# EAGLE schematic 909 Rim (EAGLE 9.0.0)
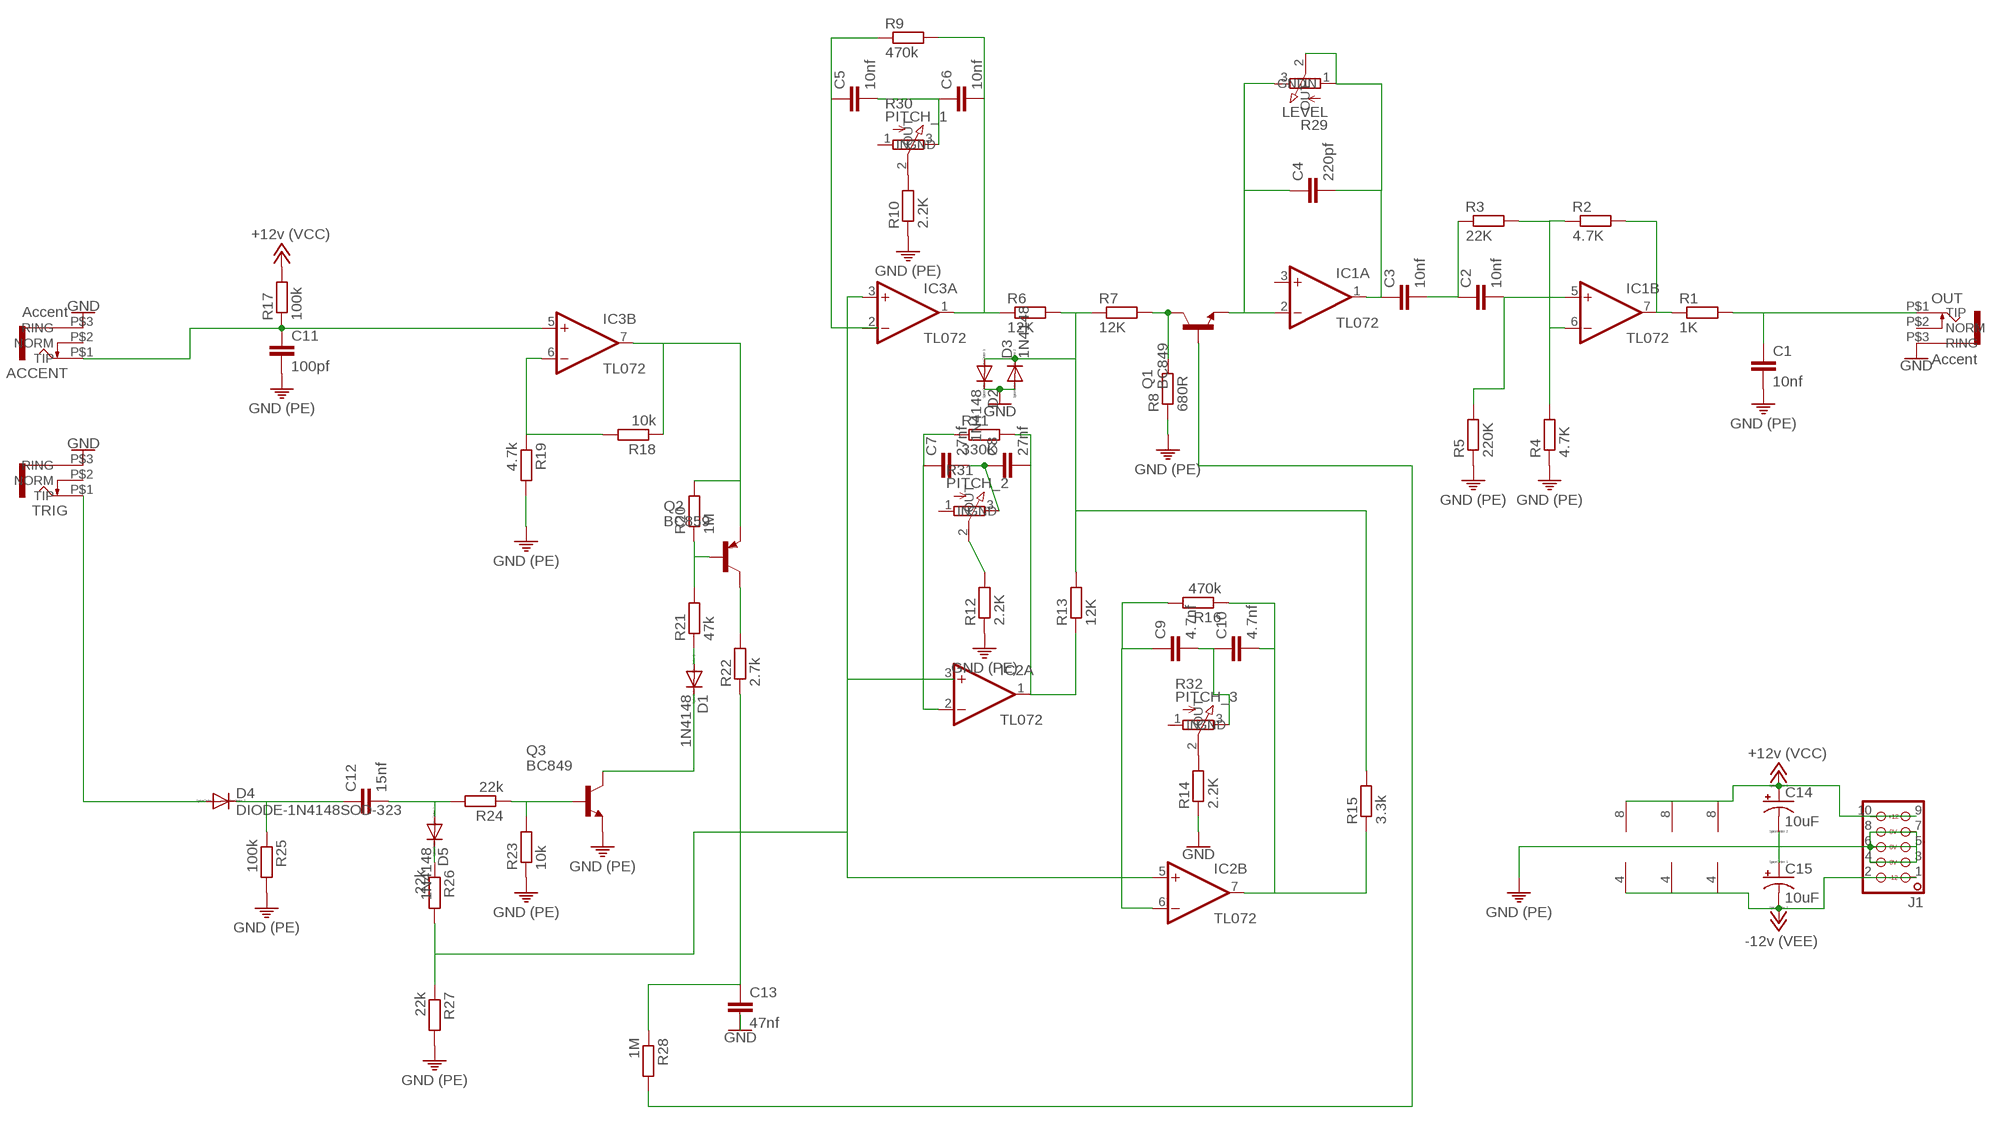
[diagram p0: schematic, sheet 1]

## Parts
ACCENT  Accent  JACK_KOBICONN_PJM301DM_V2  [KOBICONN_PJM301DM_JACK]
C1  10nf  CAPACITOR-EUC0603  [C0603]
C2  10nf  CAPACITOR-EUC0603  [C0603]
C3  10nf  CAPACITOR-EUC0603  [C0603]
C4  220pf  CAPACITOR-EUC0603  [C0603]
C5  10nf  CAPACITOR-EUC0603  [C0603]
C6  10nf  CAPACITOR-EUC0603  [C0603]
C7  27nf  CAPACITOR-EUC0603  [C0603]
C8  27nf  CAPACITOR-EUC0603  [C0603]
C9  4.7nf  CAPACITOR-EUC0603  [C0603]
C10  4.7nf  CAPACITOR-EUC0603  [C0603]
C11  100pf  CAPACITOR-EUC0603  [C0603]
C12  15nf  CAPACITOR-EUC0603  [C0603]
C13  47nf  CAPACITOR-EUC0603  [C0603]
C14  10uF  CAPACITOR_POLARIZED-USE2.5-5  [E2,5-5]
C15  10uF  CAPACITOR_POLARIZED-USE2.5-5  [E2,5-5]
D1  1N4148  DIODE-1N4148SOD-323  [SOD323W_INFINEON]
D2  1N4148  DIODE-1N4148SOD-323  [SOD323W_INFINEON]
D3  1N4148  DIODE-1N4148SOD-323  [SOD323W_INFINEON]
D4  DIODE-1N4148SOD-323  [SOD323W_INFINEON]
D5  1N4148  DIODE-1N4148SOD-323  [SOD323W_INFINEON]
IC1  TL072  OPAMP-TL072D  [SO08]
IC2  TL072  OPAMP-TL072D  [SO08]
IC3  TL072  OPAMP-TL072D  [SO08]
J1  HEADER-EUROPWR_2X05-OPEN  [2X05_EUROPWR_OPEN]
OUT  Accent  JACK_KOBICONN_PJM301DM_V2  [KOBICONN_PJM301DM_JACK]
Q1  BC849  TRANSISTOR-NPN-BC849SOT23-BEC  [SOT23-BEC]
Q2  BC859  TRANSISTOR-PNP-BC858BLT1SOT23-BEC  [SOT23-BEC]
Q3  BC849  TRANSISTOR-NPN-BC849SOT23-BEC  [SOT23-BEC]
R1  1K  RESISTOR-EU_R0603  [R0603]
R2  4.7K  RESISTOR-EU_R0603  [R0603]
R3  22K  RESISTOR-EU_R0603  [R0603]
R4  4.7K  RESISTOR-EU_R0603  [R0603]
R5  220K  RESISTOR-EU_R0603  [R0603]
R6  12K  RESISTOR-EU_R0603  [R0603]
R7  12K  RESISTOR-EU_R0603  [R0603]
R8  680R  RESISTOR-EU_R0603  [R0603]
R9  470k  RESISTOR-EU_R0603  [R0603]
R10  2.2K  RESISTOR-EU_R0603  [R0603]
R11  330K  RESISTOR-EU_R0603  [R0603]
R12  2.2K  RESISTOR-EU_R0603  [R0603]
R13  12K  RESISTOR-EU_R0603  [R0603]
R14  2.2K  RESISTOR-EU_R0603  [R0603]
R15  3.3k  RESISTOR-EU_R0603  [R0603]
R16  470k  RESISTOR-EU_R0603  [R0603]
R17  100k  RESISTOR-EU_R0603  [R0603]
R18  10k  RESISTOR-EU_R0603  [R0603]
R19  4.7k  RESISTOR-EU_R0603  [R0603]
R20  1M  RESISTOR-EU_R0603  [R0603]
R21  47k  RESISTOR-EU_R0603  [R0603]
R22  2.7k  RESISTOR-EU_R0603  [R0603]
R23  10k  RESISTOR-EU_R0603  [R0603]
R24  22k  RESISTOR-EU_R0603  [R0603]
R25  100k  RESISTOR-EU_R0603  [R0603]
R26  22k  RESISTOR-EU_R0603  [R0603]
R27  22k  RESISTOR-EU_R0603  [R0603]
R28  1M  RESISTOR-EU_R0603  [R0603]
R29  LEVEL  POT_9MM_PCB-PLS  [9MM_PLS]
R30  PITCH_1  POT_9MM_PCB-PLS  [9MM_PLS]
R31  PITCH_2  POT_9MM_PCB-PLS  [9MM_PLS]
R32  PITCH_3  POT_9MM_PCB-PLS  [9MM_PLS]
TRIG  JACK_KOBICONN_PJM301DM_V2  [KOBICONN_PJM301DM_JACK]

## Nets
+12V [GND]: C14.+ IC1.8(P:V+) J1.9 J1.10 R17.2 ; supply symbol labelled POWER+12V
-12V [GND]: C15.- IC1.4(P:V-) J1.1 J1.2 ; supply symbol labelled POWER-12V
GND [GND]: ACCENT.P$3(RING) C1.2 C11.2 C13.2 C14.- C15.+ D2.C D3.A J1.3 J1.4 J1.5 J1.6 J1.7 J1.8 OUT.P$3(RING) Q3.E R4.1 R5.1 R8.1 R10.1 R12.1 R14.1 R19.2 R23.1 R25.2 R27.2 TRIG.P$3(RING) ; supply symbol labelled POWER-GND
N$1: IC1.7(B:OUT) R1.1 R2.2
N$2: C3.1 C4.2 IC1.1(A:OUT) R29.1(GND) R29.2(OUT)
N$3: C2.1 C3.2 R3.1
N$4: C2.2 IC1.5(B:+IN) R5.2
N$5: IC1.6(B:-IN) R2.1 R3.2 R4.2
N$6: C1.1 OUT.P$1(TIP) R1.2
N$7: C4.1 IC1.2(A:-IN) Q1.E R29.3(IN)
N$8: D2.A D3.C R6.2 R7.1 R13.2 R15.2
N$9: C6.2 IC3.1(A:OUT) R6.1 R9.2
N$10: Q1.C R7.2 R8.2
N$11: C5.1 R9.1
N$12: R10.2 R30.2(OUT)
N$13: C7.2 C8.1 R31.3(IN)
N$14: C9.2 C10.1 R32.3(IN)
N$15: C10.2 IC2.7(B:OUT) R15.1 R16.1
N$16: C5.2 C6.1 R30.3(IN)
N$17: C8.2 IC2.1(A:OUT) R11.2 R13.1
N$18: C9.1 IC2.6(B:-IN) R16.2
N$19: Q1.B R28.2
N$20: ACCENT.P$1(TIP) C11.1 IC3.5(B:+IN) R17.1
N$21: IC3.6(B:-IN) R18.2 R19.1
N$22: IC3.7(B:OUT) Q2.E R18.1 R20.2
N$23: Q2.B R20.1 R21.2
N$24: Q2.C R22.2
N$25: D1.A R21.1
N$26: D5.C R26.1
N$27: C12.1 D4.C R25.1
N$28: C12.2 D5.A R24.2
N$29: IC2.5(B:+IN) IC3.3(A:+IN) R26.2 R27.1
N$30: Q3.B R23.2 R24.1
N$31: D1.C Q3.C
N$32: C13.1 R22.1 R28.1
N$33: R12.2 R31.2(OUT)
N$34: D4.A TRIG.P$1(TIP)
N$35: R14.2 R32.2(OUT)
N$37: C7.1 IC2.2(A:-IN) R11.1
Unconnected: ACCENT.P$2(NORM) IC1.3(A:+IN) IC2.3(A:+IN) IC3.2(A:-IN) OUT.P$2(NORM) R30.1(GND) R31.1(GND) R32.1(GND) TRIG.P$2(NORM)

## Power pins joined to a net without a drawn wire
V+: IC2.8(P:V+) IC3.8(P:V+)
V-: IC2.4(P:V-) IC3.4(P:V-)

## Library data of the parts
ACCENT OUT TRIG = 0000-master:JACK_KOBICONN_PJM301DM_V2
C1-C13 = 0000-master:CAPACITOR-EU: CAPACITOR, European symbol
C14 C15 = 0000-master:CAPACITOR_POLARIZED-US: POLARIZED CAPACITOR, American symbol
D1-D5 = 0000-master:DIODE-1N4148: DIODE high speed (Philips)
IC1-IC3 = 0000-master:OPAMP-TL072: OP AMP
J1 = 0000-master:HEADER-EUROPWR_2X05: 2x05 pin header
Q1 Q3 = 0000-master:TRANSISTOR-NPN-: NPN Transistror BF959 corrected 2008.03.06
Q2 = 0000-master:TRANSISTOR-PNP-: PNP Transistror
R1-R28 = 0000-master:RESISTOR-EU_: RESISTOR, European symbol
R29-R32 = 0000-master:POT_9MM_PCB: 9 mm Square Rotary Potentiometers Source: Panasonic

## Net classes
0 default: width 0.203 mm, drill 0.406 mm
1 GND: width 0.305 mm, drill 0.61 mm
2 12V: width 0.254 mm, drill 0.61 mm